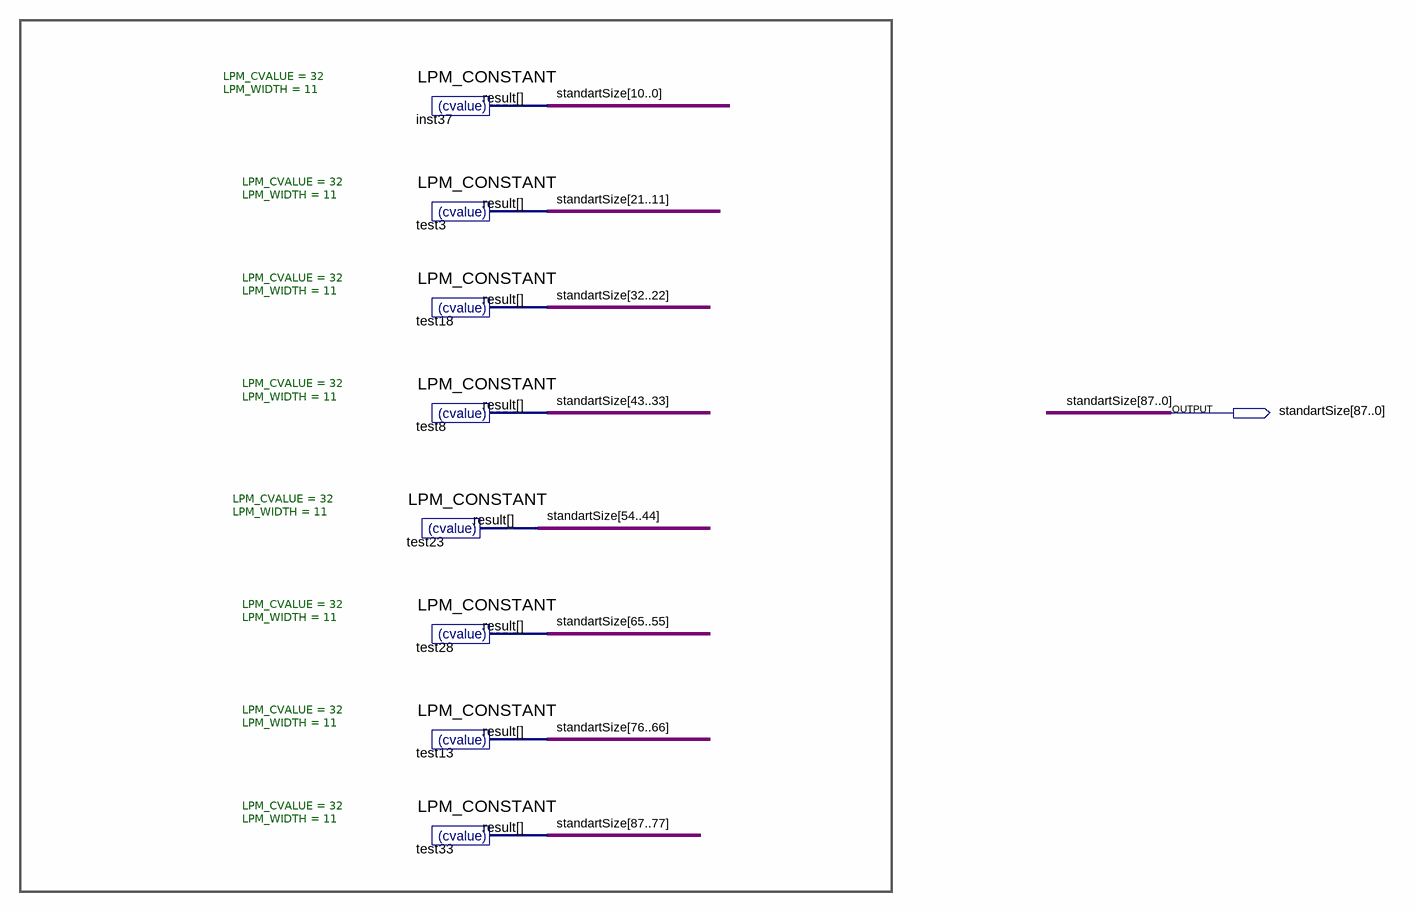
[diagram p0: schematic sheet]
// Quartus schematic standartSize.bdf as structural Verilog: 8 symbols, 1 pins
module standartSize (
  output [87:0] standartSize
);

  LPM_CONSTANT #(.LPM_CVALUE(32), .LPM_WIDTH(11)) inst37 (.result(standartSize[10:0]));
  LPM_CONSTANT #(.LPM_CVALUE(32), .LPM_WIDTH(11)) test3 (.result(standartSize[21:11]));
  LPM_CONSTANT #(.LPM_CVALUE(32), .LPM_WIDTH(11)) test18 (.result(standartSize[32:22]));
  LPM_CONSTANT #(.LPM_CVALUE(32), .LPM_WIDTH(11)) test8 (.result(standartSize[43:33]));
  LPM_CONSTANT #(.LPM_CVALUE(32), .LPM_WIDTH(11)) test23 (.result(standartSize[54:44]));
  LPM_CONSTANT #(.LPM_CVALUE(32), .LPM_WIDTH(11)) test28 (.result(standartSize[65:55]));
  LPM_CONSTANT #(.LPM_CVALUE(32), .LPM_WIDTH(11)) test13 (.result(standartSize[76:66]));
  LPM_CONSTANT #(.LPM_CVALUE(32), .LPM_WIDTH(11)) test33 (.result(standartSize[87:77]));
endmodule
